# Altium schematic sheet LPCB219 - LASER DISTANCE.SchDoc
size A3; Address1: Factory 10; Address2: 9-13 Dingley Avenue, Dandeong, VICTORIA 3175, AUSTRALIA; DocumentNumber: 2; Revision: 1; SheetNumber: 2; SheetTotal: 7; Lockie__PCB_SUB_ASSEMBLY: Laser Distance; Lockie__PCB_ASSEMBLY: Main; Lockie__LDL: LPCB219; Lockie__PCB_DESCRIPTION: Control Node
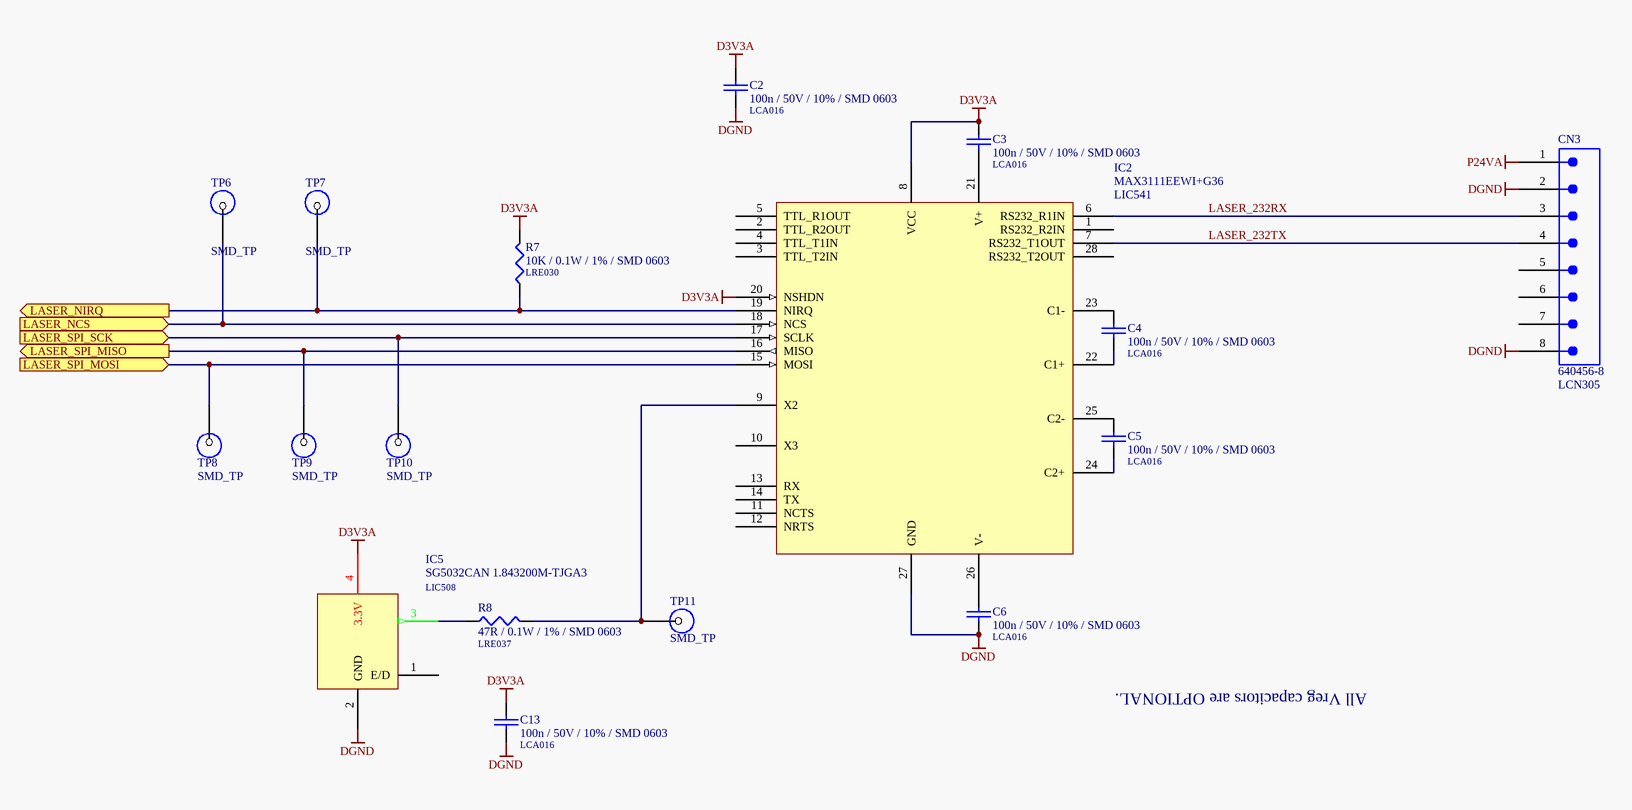
[diagram p0: LPCB219 - LASER DISTANCE.SchDoc]

## Parts
C2  100n / 50V / 10% / SMD 0603  LDL_NUMBER: LCA016  [LFP011__CC1608-0603-IPC7351_B]
C3  100n / 50V / 10% / SMD 0603  LDL_NUMBER: LCA016  [LFP011__CC1608-0603-IPC7351_B]
C4  100n / 50V / 10% / SMD 0603  LDL_NUMBER: LCA016  [LFP011__CC1608-0603-IPC7351_B]
C5  100n / 50V / 10% / SMD 0603  LDL_NUMBER: LCA016  [LFP011__CC1608-0603-IPC7351_B]
C6  100n / 50V / 10% / SMD 0603  LDL_NUMBER: LCA016  [LFP011__CC1608-0603-IPC7351_B]
C13  100n / 50V / 10% / SMD 0603  LDL_NUMBER: LCA016  [LFP011__CC1608-0603-IPC7351_B]
CN3  640456-8  LDL_NUMBER: LCN305  [640456-8]
IC2  MAX3111EEWI+G36  LDL_NUMBER: LIC541  [LFP024__SOIC300-28]
IC5  SG5032CAN 1.843200M-TJGA3  LDL_NUMBER: LIC508  [LFP072__ASFLMB]
R7  10K / 0.1W / 1% / SMD 0603  LDL_NUMBER: LRE030  [LFP020__CR1608-0603-IPC7351_B]
R8  47R / 0.1W / 1% / SMD 0603  LDL_NUMBER: LRE037  [LFP020__CR1608-0603-IPC7351_B]
TP6  SMD_TP  [SMD-TP]  (no BOM)
TP7  SMD_TP  [SMD-TP]  (no BOM)
TP8  SMD_TP  [SMD-TP]  (no BOM)
TP9  SMD_TP  [SMD-TP]  (no BOM)
TP10  SMD_TP  [SMD-TP]  (no BOM)
TP11  SMD_TP  [SMD-TP]  (no BOM)

## Ports
LASER_NCS (in), LASER_NIRQ (out), LASER_SPI_MISO (out), LASER_SPI_MOSI (in), LASER_SPI_SCK (in)

## Nets
D3V3A: C2.1 C3.1 C13.1 IC2.8(VCC) IC2.20(NSHDN) IC5.4(3.3V) R7.2
DGND: C2.2 C6.2 C13.2 CN3.2 CN3.8 IC2.27(GND) IC5.2(GND)
P24VA: CN3.1
LASER_232RX: CN3.3 IC2.6(RS232_R1IN)
LASER_232TX: CN3.4 IC2.7(RS232_T1OUT)
LASER_NCS: IC2.18(NCS) TP6.1 ; port LASER_NCS
LASER_NIRQ: IC2.19(NIRQ) R7.1 TP7.1 ; port LASER_NIRQ
LASER_SPI_MISO: IC2.16(MISO) TP9.1 ; port LASER_SPI_MISO
LASER_SPI_MOSI: IC2.15(MOSI) TP8.1 ; port LASER_SPI_MOSI
LASER_SPI_SCK: IC2.17(SCLK) TP10.1 ; port LASER_SPI_SCK
NetC3_2: C3.2 IC2.21(V+)
NetC4_1: C4.1 IC2.23(C1-)
NetC4_2: C4.2 IC2.22(C1+)
NetC5_1: C5.1 IC2.25(C2-)
NetC5_2: C5.2 IC2.24(C2+)
NetC6_1: C6.1 IC2.26(V-)
NetIC2_9: IC2.9(X2) R8.2 TP11.1
NetIC5_3: IC5.3(OUT) R8.1

Not connected (* = marked no-connect by the designer): CN3 5 6 7; IC2 1(RS232_R2IN) 2(TTL_R2OUT) 3(TTL_T2IN) 4(TTL_T1IN) 5(TTL_R1OUT) 10(X3) 11(NCTS) 12(NRTS) 13(RX) 14(TX) 28(RS232_T2OUT); IC5 1(E/D)

## Notes on the sheet
- All Vreg capacitors are OPTIONAL.
- PCB COMPONENT DESCRIPTION
- LDL NUMBER
- Assembly Details
- Size
- Drawing File Name
- Revision
- http://rloop.org
- Scale
- A3
- Sheet Details
- N.T.S
- Sheet:
- Of:

## Library data of the parts
C2-C6 C13 = 100n / 50V / 10% / SMD 0603: Capacitor, Ceramic Chip, 100nF (0.1uF), 50V, 5%, SMD 0603 [LCA016]; FMEDA__OPERATING__VOLTAGE_MIN: 0; FMEDA__OPERATING__VOLTAGE_MAX: 3.3; FMEDA__OPERATING__TEMP_MIN: -20; FMEDA__OPERATING__TEMP_TYP: 27; FMEDA__OPERATING__TEMP_MAX: 50; FMEDA__CHANNEL: COM; Value: 100n; FMEDA__FUNCTION_IN_SYSTEM: *; FMEDA__OPERATING__VOLTAGE_TYP: 3.3
CN3 = 640456-8: Connector, Male Header, 8 Way; FMEDA__CHANNEL: COM; FMEDA__OPERATING__CURRENT_MAX: 0; FMEDA__OPERATING__TEMP_MAX: 50; FMEDA__OPERATING__TEMP_MIN: -20; FMEDA__OPERATING__TEMP_TYP: 27; FMEDA__OPERATING__VOLTAGE_MAX: 16; FMEDA__OPERATING__VOLTAGE_TYP: 12; FMEDA__FUNCTION_IN_SYSTEM: *; FMEDA__OPERATING__CURRENT_MIN: 0; FMEDA__OPERATING__CURRENT_TYP: 0; FMEDA__OPERATING__VOLTAGE_MIN: 0
IC2 = MAX3111EEWI+G36: IC, SPI UART Interface, SMD SOIC28 [LIC541]
IC5 = SG5032CAN 1.843200M-TJGA3: IC, Oscillator Module, 1.8432MHz, 3.3V, SMD [LIC508]; FMEDA__OPERATING__TEMP_MAX: 50; FMEDA__OPERATING__TEMP_MIN: -20; FMEDA__OPERATING__TEMP_TYP: 27; FMEDA__OPERATING__VOLTAGE_MAX: 3.3; FMEDA__OPERATING__VOLTAGE_MIN: 0; FMEDA__CHANNEL: COM; FMEDA__OPERATING__VOLTAGE_TYP: 3.3; FMEDA__FUNCTION_IN_SYSTEM: *
R7 = 10K / 0.1W / 1% / SMD 0603: Resistor, Ceramic Chip, 10K, 0.1W, 1%, SMD 0603 [LRE030]; FMEDA__OPERATING__POWER_MAX: 0; FMEDA__OPERATING__TEMP_MAX: 50; FMEDA__OPERATING__TEMP_MIN: -20; FMEDA__OPERATING__TEMP_TYP: 27; FMEDA__CHANNEL: COM; Value: 10K; FMEDA__OPERATING__POWER_MIN: 0; FMEDA__OPERATING__VOLTAGE_MAX: 0; FMEDA__OPERATING__VOLTAGE_MIN: 0; FMEDA__OPERATING__VOLTAGE_TYP: 0; FMEDA__FUNCTION_IN_SYSTEM: *
R8 = 47R / 0.1W / 1% / SMD 0603: Resistor, Ceramic Chip, 47R, 0.1W, 1%, SMD 0603 [LRE037]; VALUE: 47; FMEDA__OPERATING__POWER_MAX: 0; FMEDA__OPERATING__TEMP_MAX: 50; FMEDA__OPERATING__TEMP_MIN: -20; FMEDA__OPERATING__TEMP_TYP: 27; FMEDA__CHANNEL: COM; FMEDA__OPERATING__POWER_MIN: 0; FMEDA__OPERATING__VOLTAGE_MAX: 0; FMEDA__OPERATING__VOLTAGE_MIN: 0; FMEDA__OPERATING__VOLTAGE_TYP: 0; FMEDA__FUNCTION_IN_SYSTEM: *
TP6-TP11 = SMD_TP: SMD Test Point; FMEDA__CHANNEL: COM; FMEDA__OPERATING__CURRENT_MAX: 0; FMEDA__OPERATING__TEMP_MAX: 50; FMEDA__OPERATING__TEMP_MIN: -20; FMEDA__OPERATING__TEMP_TYP: 27; FMEDA__OPERATING__VOLTAGE_MAX: 16; FMEDA__OPERATING__VOLTAGE_TYP: 12; FMEDA__OPERATING__CURRENT_MIN: 0; FMEDA__OPERATING__CURRENT_TYP: 0; FMEDA__OPERATING__VOLTAGE_MIN: 0